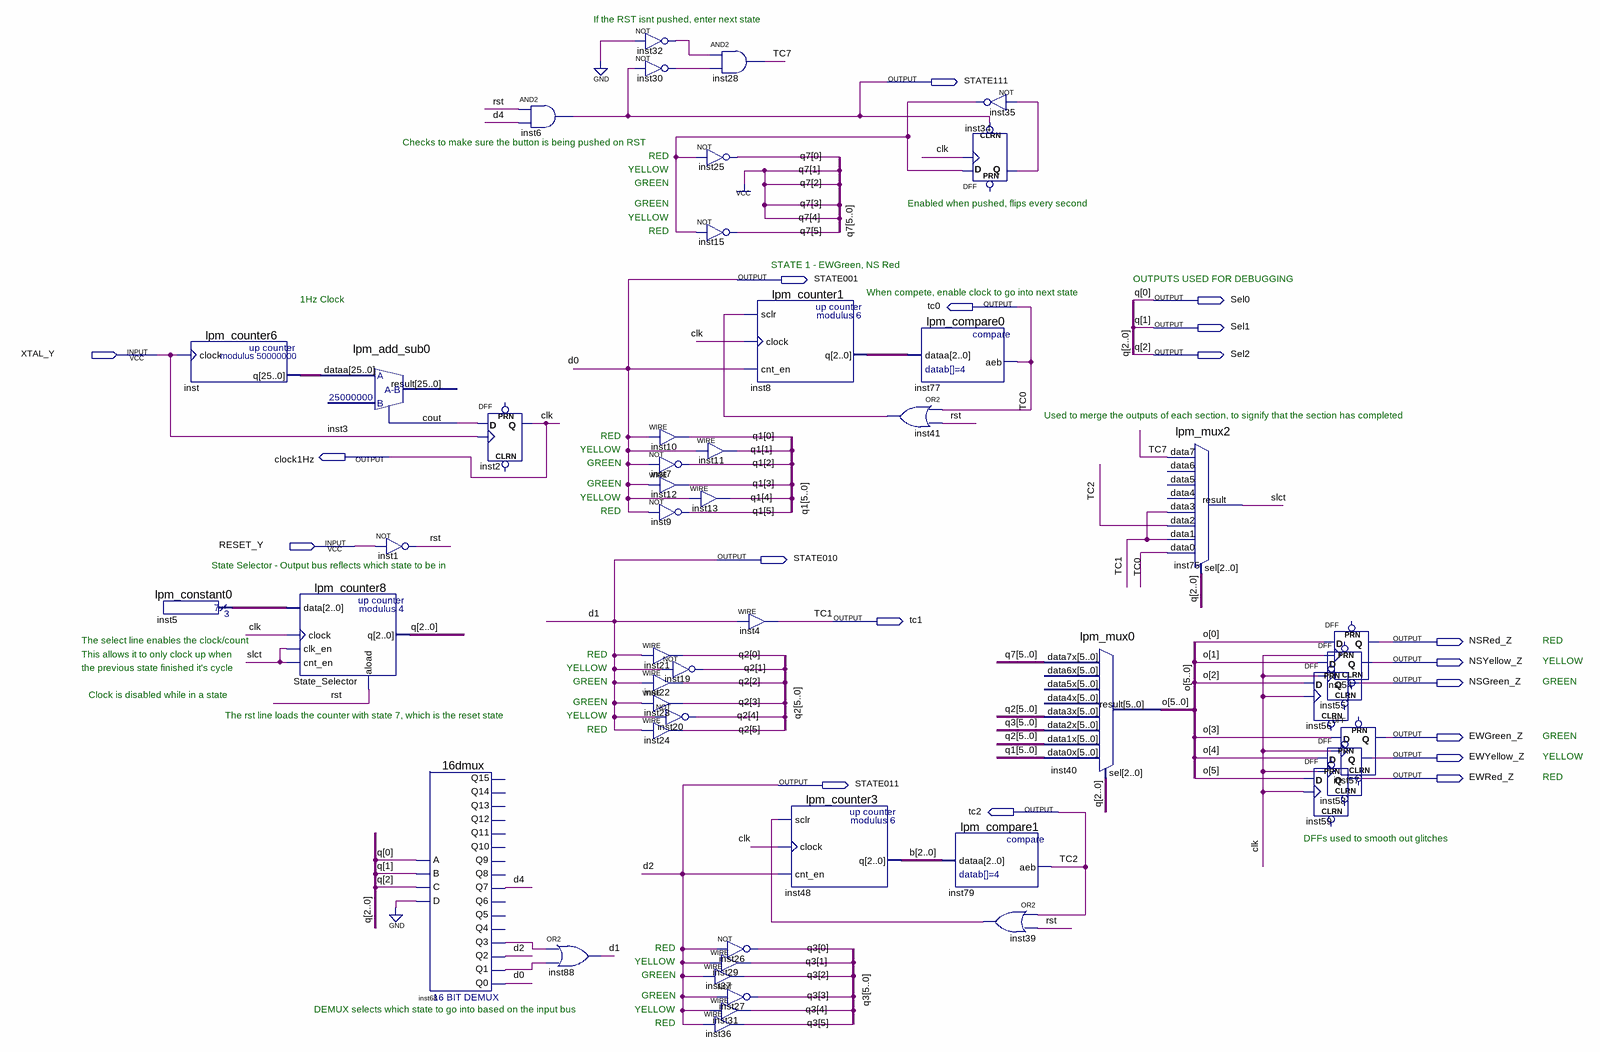
[diagram p0: schematic sheet]
// Quartus schematic design2TN.bdf as structural Verilog: 49 symbols, 19 pins
module design2TN (
  input  XTAL_Y,
  input  RESET_Y,
  output STATE111,
  output STATE001,
  output Sel0,
  output tc0,
  output Sel1,
  output Sel2,
  output clock1Hz,
  output STATE010,
  output tc1,
  output NSRed_Z,
  output NSYellow_Z,
  output NSGreen_Z,
  output EWGreen_Z,
  output EWYellow_Z,
  output EWRed_Z,
  output STATE011,
  output tc2
);

  wire d4, inst3_cout, inst30_out, inst32_out, inst34_q, inst35_out, inst39_out, inst41_out, inst68_q1,
       inst68_q3, rst, slct, TC7;
  wire [2:0] b, inst5_result, inst8_q;
  wire [5:0] o, q1, q2, q3, q7;
  wire [25:0] inst_q;

  lpm_counter6 inst (.clock(XTAL_Y), .q(inst_q));
  lpm_constant0 inst5 (.result(inst5_result));
  lpm_counter8 State_Selector (
    .data(inst5_result), .clock(clock1Hz), .clk_en(slct), .cnt_en(slct), .aload(rst), .q({Sel2, Sel1, Sel0}));
  lpm_add_sub0 inst3 (.dataa(inst_q), .cout(inst3_cout));  // open: result
  not inst1 (rst, RESET_Y);
  \16dmux  inst68 (
    .C(Sel2), .B(Sel1), .A(Sel0), .D(1'b0), .Q7(d4), .Q2(STATE011), .Q3(inst68_q3), .Q0(STATE001),
    .Q1(inst68_q1));  // open: Q12, Q13, Q11, Q9, Q10, Q8, Q4, Q5, Q6, Q14, Q15
  and inst6 (STATE111, rst, d4);
  DFF inst2 (.CLK(XTAL_Y), .D(inst3_cout), .Q(clock1Hz));  // open: CLRN, PRN
  or inst88 (STATE010, inst68_q3, inst68_q1);
  not inst32 (inst32_out, 1'b0);
  not inst30 (inst30_out, STATE111);
  assign q1[0] = STATE001;  // WIRE inst10
  not inst7 (q1[2], STATE001);
  assign q1[3] = STATE001;  // WIRE inst12
  not inst9 (q1[5], STATE001);
  assign q2[0] = STATE010;  // WIRE inst21
  not inst19 (q2[1], STATE010);
  assign q2[2] = STATE010;  // WIRE inst22
  assign q2[3] = STATE010;  // WIRE inst23
  not inst20 (q2[4], STATE010);
  assign q2[5] = STATE010;  // WIRE inst24
  and inst28 (TC7, inst32_out, inst30_out);
  not inst25 (q7[0], inst35_out);
  not inst15 (q7[5], inst35_out);
  assign q1[1] = STATE001;  // WIRE inst11
  assign q1[4] = STATE001;  // WIRE inst13
  assign tc1 = STATE010;  // WIRE inst4
  not inst26 (q3[0], STATE011);
  assign q3[1] = STATE011;  // WIRE inst29
  assign q3[2] = STATE011;  // WIRE inst37
  not inst27 (q3[3], STATE011);
  assign q3[4] = STATE011;  // WIRE inst31
  assign q3[5] = STATE011;  // WIRE inst36
  lpm_counter1 inst8 (.sclr(inst41_out), .clock(clock1Hz), .cnt_en(STATE001), .q(inst8_q));
  lpm_counter3 inst48 (.sclr(inst39_out), .clock(clock1Hz), .cnt_en(STATE011), .q(b));
  or inst41 (inst41_out, tc0, rst);
  lpm_compare0 inst77 (.dataa(inst8_q), .aeb(tc0));
  lpm_compare1 inst79 (.dataa(b), .aeb(tc2));
  not inst35 (inst35_out, inst34_q);
  DFF inst34 (.CLRN(STATE111), .CLK(clock1Hz), .D(inst35_out), .Q(inst34_q));  // open: PRN
  or inst39 (inst39_out, tc2, rst);
  lpm_mux0 inst40 (
    .data7x({q7[5], 4'b1111, q7[0]}), .data3x(q2), .data2x(q3), .data1x(q2), .data0x(q1),
    .sel({Sel2, Sel1, Sel0}), .result(o));  // open: data6x, data5x, data4x
  lpm_mux2 inst75 (
    .data7(TC7), .data3(tc1), .data2(tc2), .data1(tc1), .data0(tc0), .sel({Sel2, Sel1, Sel0}), .result(slct));  // open: data6, data5, data4
  DFF inst54 (.CLK(clock1Hz), .D(o[0]), .Q(NSRed_Z));  // open: CLRN, PRN
  DFF inst55 (.CLK(clock1Hz), .D(o[1]), .Q(NSYellow_Z));  // open: CLRN, PRN
  DFF inst56 (.CLK(clock1Hz), .D(o[2]), .Q(NSGreen_Z));  // open: CLRN, PRN
  DFF inst57 (.CLK(clock1Hz), .D(o[3]), .Q(EWGreen_Z));  // open: CLRN, PRN
  DFF inst58 (.CLK(clock1Hz), .D(o[4]), .Q(EWYellow_Z));  // open: CLRN, PRN
  DFF inst59 (.CLK(clock1Hz), .D(o[5]), .Q(EWRed_Z));  // open: CLRN, PRN

  // Other names for the same wires on the sheet: clk = clock1Hz; d0 = STATE001; d1 = STATE010; d2 = STATE011;
  //   q[2:0] = {Sel2, Sel1, Sel0}

  // Notes on the sheet:
  //   If the RST isnt pushed, enter next state
  //   Checks to make sure the button is being pushed on RST
  //   RED
  //   YELLOW
  //   GREEN
  //   GREEN
  //   Enabled when pushed, flips every second
  //   YELLOW
  //   RED
  //   STATE 1 - EWGreen, NS Red
  //   OUTPUTS USED FOR DEBUGGING
  //   When compete, enable clock to go into next state
  //   1Hz Clock
  //   Used to merge the outputs of each section, to signify that the section has completed
  //   RED
  //   YELLOW
  //   GREEN
  //   GREEN
  //   YELLOW
  //   RED
  //   State Selector - Output bus reflects which state to be in
  //   The select line enables the clock/count
  //   RED
  //   This allows it to only clock up when
  //   RED
  //   YELLOW
  //   the previous state finished it's cycle
  //   YELLOW
  //   GREEN
  //   GREEN
  //   Clock is disabled while in a state
  //   GREEN
  //   The rst line loads the counter with state 7, which is the reset state
  //   YELLOW
  //   RED
  //   GREEN
  //   YELLOW
  //   RED
  //   DFFs used to smooth out glitches
  //   RED
  //   YELLOW
  //   GREEN
  //   GREEN
  //   DEMUX selects which state to go into based on the input bus
  //   YELLOW
  //   RED
endmodule
